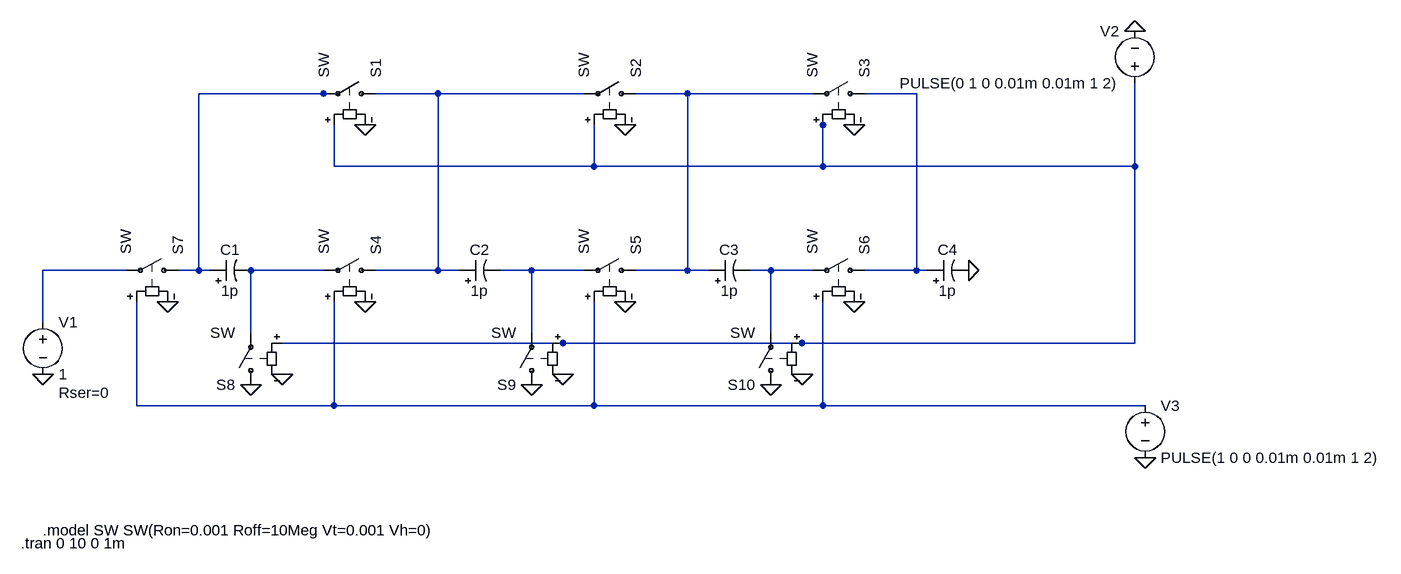
[diagram p0: schematic Draft1.asc]
Draft1.asc, the LTspice schematic file:
Version 4
SHEET 1 2108 680
WIRE 480 -208 288 -208
WIRE 496 -208 480 -208
WIRE 656 -208 560 -208
WIRE 880 -208 656 -208
WIRE 1040 -208 960 -208
WIRE 1232 -208 1040 -208
WIRE 1392 -208 1312 -208
WIRE 1248 -160 1248 -176
WIRE 496 -96 496 -160
WIRE 896 -96 896 -160
WIRE 896 -96 496 -96
WIRE 1248 -96 1248 -160
WIRE 1248 -96 896 -96
WIRE 1728 -96 1728 -224
WIRE 1728 -96 1248 -96
WIRE 176 64 48 64
WIRE 288 64 288 -208
WIRE 288 64 256 64
WIRE 304 64 288 64
WIRE 480 64 368 64
WIRE 656 64 656 -208
WIRE 656 64 560 64
WIRE 688 64 656 64
WIRE 800 64 752 64
WIRE 880 64 800 64
WIRE 1040 64 1040 -208
WIRE 1040 64 960 64
WIRE 1072 64 1040 64
WIRE 1168 64 1136 64
WIRE 1232 64 1168 64
WIRE 1392 64 1392 -208
WIRE 1392 64 1312 64
WIRE 1408 64 1392 64
WIRE 48 144 48 64
WIRE 368 160 368 64
WIRE 800 160 800 64
WIRE 1168 160 1168 64
WIRE 848 176 416 176
WIRE 1216 176 848 176
WIRE 1728 176 1728 -96
WIRE 1728 176 1216 176
WIRE 192 272 192 112
WIRE 496 272 496 112
WIRE 496 272 192 272
WIRE 896 272 896 112
WIRE 896 272 496 272
WIRE 1248 272 1248 112
WIRE 1248 272 896 272
WIRE 1744 272 1248 272
FLAG 1472 64 0
FLAG 48 224 0
FLAG 416 224 0
FLAG 848 224 0
FLAG 800 240 0
FLAG 368 240 0
FLAG 1168 240 0
FLAG 1216 224 0
FLAG 544 112 0
FLAG 944 112 0
FLAG 1296 112 0
FLAG 944 -160 0
FLAG 1296 -160 0
FLAG 1728 -304 0
FLAG 1744 352 0
FLAG 544 -160 0
FLAG 240 112 0
SYMBOL voltage 48 128 R0
WINDOW 123 0 0 Left 2
WINDOW 39 24 124 Left 2
SYMATTR InstName V1
SYMATTR Value 1
SYMATTR SpiceLine Rser=0
SYMBOL polcap 304 80 R270
WINDOW 0 32 32 VTop 2
WINDOW 3 0 32 VBottom 2
SYMATTR InstName C1
SYMATTR Value 1p
SYMBOL polcap 688 80 R270
WINDOW 0 32 32 VTop 2
WINDOW 3 0 32 VBottom 2
SYMATTR InstName C2
SYMATTR Value 1p
SYMBOL polcap 1072 80 R270
WINDOW 0 32 32 VTop 2
WINDOW 3 0 32 VBottom 2
SYMATTR InstName C3
SYMATTR Value 1p
SYMBOL polcap 1408 80 R270
WINDOW 0 32 32 VTop 2
WINDOW 3 0 32 VBottom 2
SYMATTR InstName C4
SYMATTR Value 1p
SYMBOL sw 576 -208 M270
SYMATTR InstName S1
SYMBOL sw 976 -208 M270
SYMATTR InstName S2
SYMBOL sw 1328 -208 M270
SYMATTR InstName S3
SYMBOL sw 576 64 M270
SYMATTR InstName S4
SYMBOL sw 976 64 M270
SYMATTR InstName S5
SYMBOL sw 1328 64 M270
SYMATTR InstName S6
SYMBOL sw 272 64 M270
SYMATTR InstName S7
SYMBOL sw 368 256 R180
SYMATTR InstName S8
SYMBOL sw 800 256 R180
SYMATTR InstName S9
SYMBOL sw 1168 256 R180
SYMATTR InstName S10
SYMBOL voltage 1728 -208 R180
WINDOW 0 24 96 Left 2
WINDOW 3 24 16 Left 2
WINDOW 123 0 0 Left 2
WINDOW 39 0 0 Left 2
SYMATTR InstName V2
SYMATTR Value PULSE(0 1 0 0.01m 0.01m 1 2)
SYMBOL voltage 1744 256 R0
WINDOW 123 0 0 Left 2
WINDOW 39 0 0 Left 2
SYMATTR InstName V3
SYMATTR Value PULSE(1 0 0 0.01m 0.01m 1 2)
TEXT 48 464 Left 2 !.model SW SW(Ron=0.001 Roff=10Meg Vt=0.001 Vh=0)
TEXT 14 484 Left 2 !.tran 0 10 0 1m

The netlist it stands for:
* Draft1.asc
V1 N006 0 1 Rser=0
C1 N001 N007 1p
C2 N002 N008 1p
C3 N003 N009 1p
C4 N004 0 1p
S1 N002 N001 N005 0 SW
S2 N003 N002 N005 0 SW
S3 N004 N003 N005 0 SW
S4 N002 N007 N010 0 SW
S5 N003 N008 N010 0 SW
S6 N004 N009 N010 0 SW
S7 N001 N006 N010 0 SW
S8 0 N007 N005 0 SW
S9 0 N008 N005 0 SW
S10 0 N009 N005 0 SW
V2 N005 0 PULSE(0 1 0 0.01m 0.01m 1 2)
V3 N010 0 PULSE(1 0 0 0.01m 0.01m 1 2)
.model SW SW(Ron=0.001 Roff=10Meg Vt=0.001 Vh=0)
.tran 0 10 0 1m
.backanno
.end